# Altium schematic sheet ADXL345_5V.SchDoc
size A
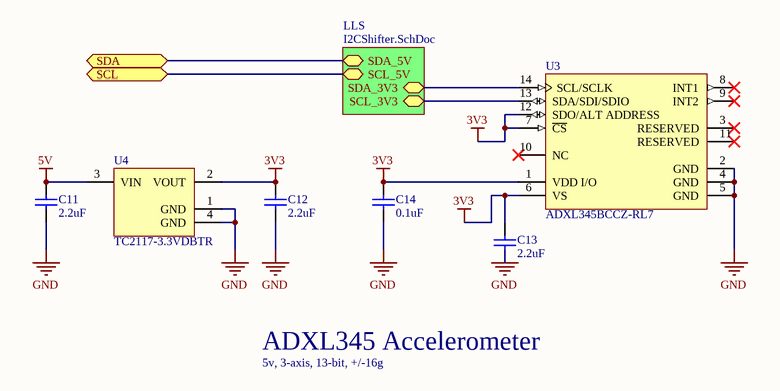
[diagram p0: ADXL345_5V.SchDoc]

## Parts
C11  2.2uF  [CAPC0603(1608)100_L]
C12  2.2uF  [CAPC0603(1608)100_L]
C13  2.2uF  [CAPC0603(1608)100_L]
C14  0.1uF  [CAPC0603(1608)100_L]
U3  ADXL345BCCZ-RL7  [ADI-CC-14-1_V]
U4  TC2117-3.3VDBTR  [SOT-223-DB3_L]

## Sub-sheets
LLS = I2CShifter.SchDoc: SDA_3V3 (bidir), SCL_3V3 (bidir), SDA_5V (bidir), SCL_5V (bidir)

## Ports
SCL (bidir), SDA

## Nets
3V3: C12.2 C13.2 C14.2 U3.1(VDD_I/O) U3.6(VS) U3.7(~{CS}) U3.12(SDO/ALT_ADDRESS) U4.2(VOUT)
5V: C11.2 U4.3(VIN)
GND: C11.1 C12.1 C13.1 C14.1 U3.2(GND) U3.4(GND) U3.5(GND) U4.1(GND) U4.4(GND)
SCL: port SCL, sheet LLS/SCL_5V
SDA: port SDA, sheet LLS/SDA_5V
NetU3_13: U3.13(SDA/SDI/SDIO) ; sheet LLS/SCL_3V3
NetU3_14: U3.14(SCL/SCLK) ; sheet LLS/SDA_3V3

Not connected (* = marked no-connect by the designer): U3 3(RESERVED)* 8(INT1)* 9(INT2)* 10(NC)* 11(RESERVED)*

## Notes on the sheet
- ADXL345 Accelerometer
- 5v, 3-axis, 13-bit, +/-16g

## Library data of the parts
C11-C13 = CMP-1035-02767-1: CAP 2.2uF 25V ±10% 0603 (1608 Metric) Thickness 1mm SMD; Case-EIA: 0603; Tolerance: Â±10%; Case-Metric: 1608; Technology: SMT; Value: 2.2uF; Max Thickness: 1 mm; Rated Voltage: 25 V
C14 = CMP-1035-02591-1: CAP 100nF 50V ±5% 0603 (1608 Metric) Thickness 1mm SMD; Tolerance: Â±5%; Case-Metric: 1608; Case-EIA: 0603; Rated Voltage: 50 V; Max Thickness: 1 mm; Technology: SMT; Value: 100nF
U3 = CMP-0885-00033-1: 3-Axis, +/-2 g / +/-4 g / +/-8 g / +/-16 g Digital Accelerometer with Digital Output, 1.6 KHz BW, Industrial, 14-pin LGA, Reel; Manufacturer: Analog Devices; Supply Current: 140 uA; Voltage Supply (V): 2.0 to 3.6; -3dB Bandwidth: 1.6 KHz; Sensitivity: 256/128/64/32 LSB/g; # of Axes: 3; Output Type: Digital; PackageDescription: 14-Pin Land Grid Array, 3 x 5 mm Body, 0.8 mm Pitch; ComponentLink1URL: http://www.analog.com/en/index.html; ComponentLink2Description: Datasheet; PartNumber: ADXL345BCCZ-RL7; ComponentLink3Description: Package Specification; ComponentLink4URL: http://www.analog.com/en/mems-sensors/mems-inertial-sensors/adxl345/products/product.html; PackageVersion: 03-16-2010-A, 03/2010; ComponentLink1Description: Manufacturer URL; ComponentLink2URL: http://www.analog.com/static/imported-files/data_sheets/ADXL345.pdf; DatasheetVersion: Rev. D; PackageReference: CC-14-1; Packing: Reel; Mounting Technology: Surface Mount; ComponentLink4Description: Product URL; ComponentLink3URL: http://www.analog.com/static/imported-files/data_sheets/ADXL343.pdf
U4 = CMP-0136-00509-1: 800 mA Fixed Low Dropout Positive Regulator, 3-Pin SOT-223, Extended Temperature, Tape and Reel; PackageVersion: revBB, Aug-2009; DatasheetVersion: revC, Oct-2006; PackageReference: SOT-223-DB3; PackageDescription: 3-Lead Plastic Small Outline Transistor (DB) [SOT-223]